# EAGLE schematic MainPower (EAGLE 9.6.2)

## Sheet 1 of 2
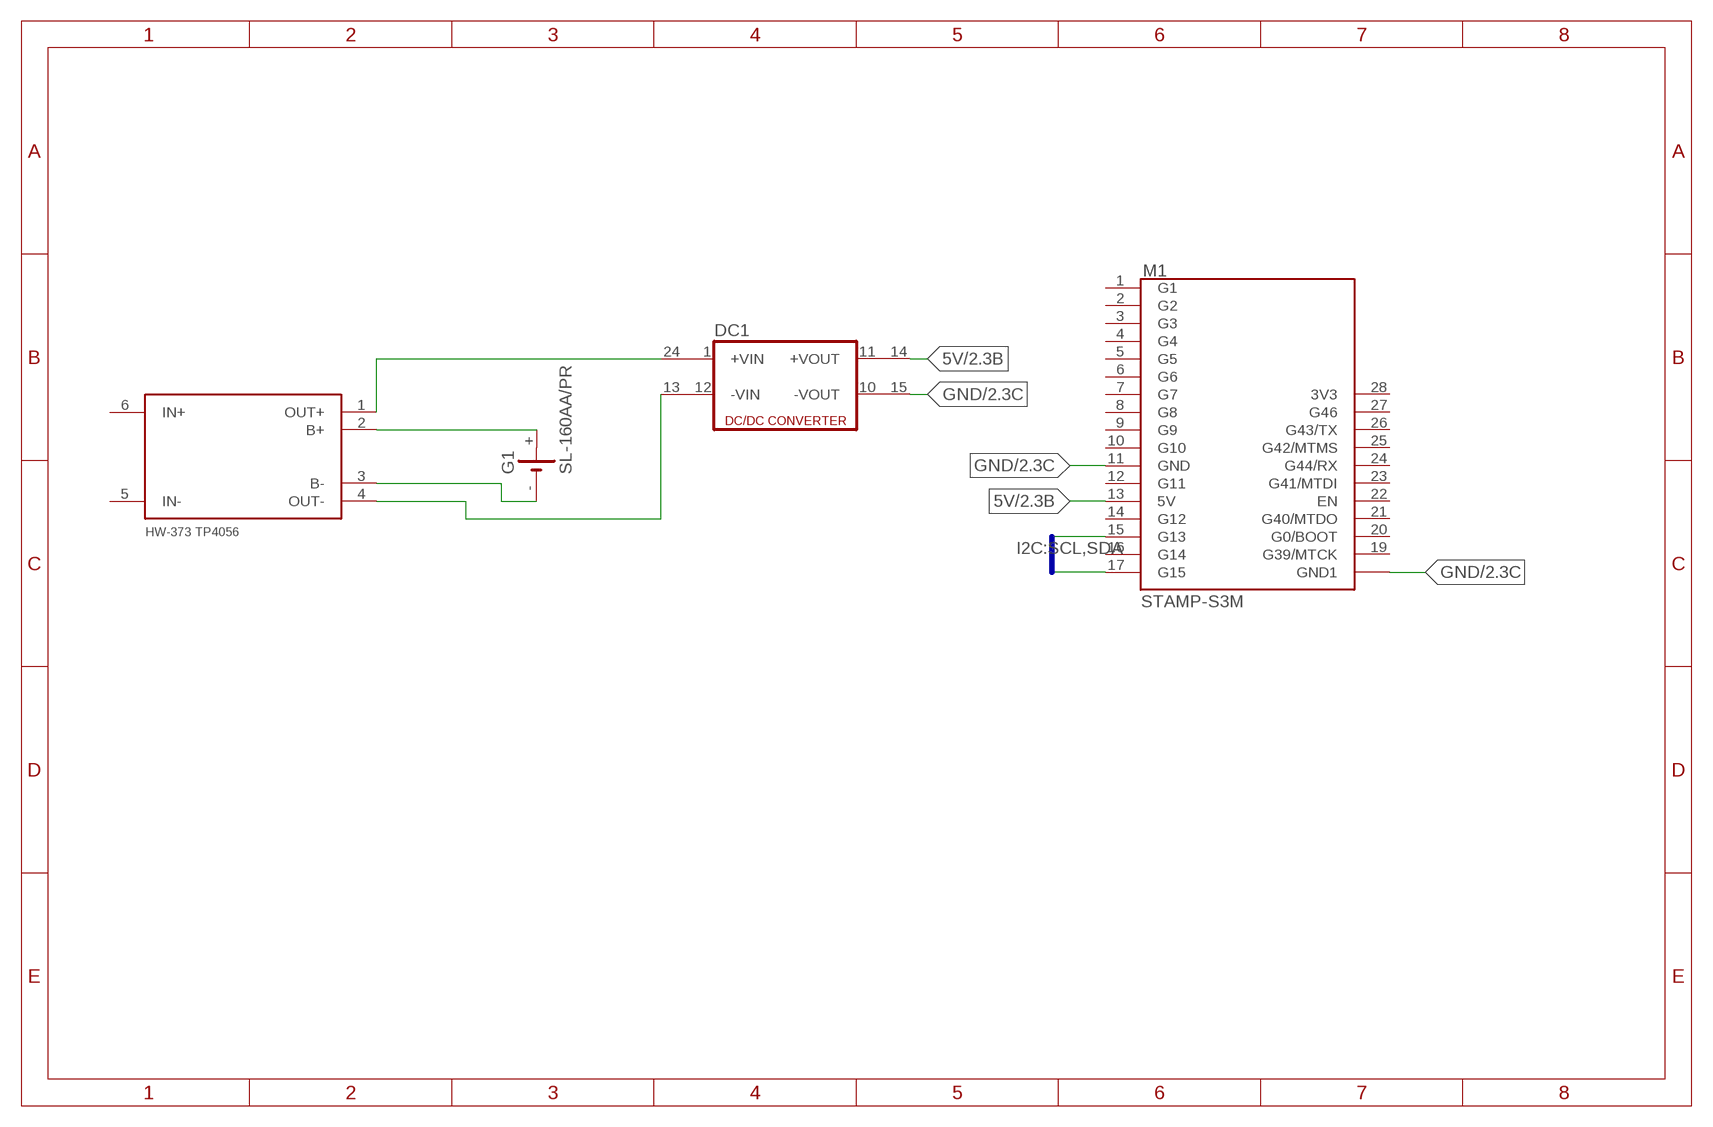
[diagram p0: schematic, sheet 1]

### Parts
DC1  DC213R  [CMK]
G1  SL-160AA/PR  [SL-160AA/PR]
U$1  TP4056  [TP4056_FTP]
U$2  STAMP-S3M-PIN  [STAMPS3_PIN_FTP]

### Nets
5V: DC1.14(+VOUT1) U$2.13(5V) ; also sheet 2
GND: DC1.15(-VOUT1) U$2.11(GND) U$2.18(GND1) ; also sheet 2
N$2: G1.+ U$1.2(B+)
N$3: G1.- U$1.3(B-)
N$4: DC1.13(-VIN1) U$1.4(OUT-)
N$5: DC1.24(+VIN1) U$1.1(OUT+)
SCL: U$2.17(G15) ; also sheet 2
SDA: U$2.15(G13) ; also sheet 2
Unconnected: DC1.1(+VIN) DC1.10(-VOUT) DC1.11(+VOUT) DC1.12(-VIN) U$1.5(IN-) U$2.1(G1) U$2.2(G2) U$2.3(G3) U$2.4(G4) U$2.5(G5) U$2.6(G6) U$2.7(G7) U$2.8(G8) U$2.9(G9) U$2.10(G10) U$2.12(G11) U$2.14(G12) U$2.16(G14) U$2.19(G39/MTCK) U$2.20(G0/BOOT) U$2.21(G40/MTDO) U$2.22(EN) U$2.23(G41/MTDI) U$2.24(G44/RX) U$2.25(G42/MTMS) U$2.26(G43/TX) U$2.27(G46)

### Buses
I2C:SCL,SDA

## Sheet 2 of 2
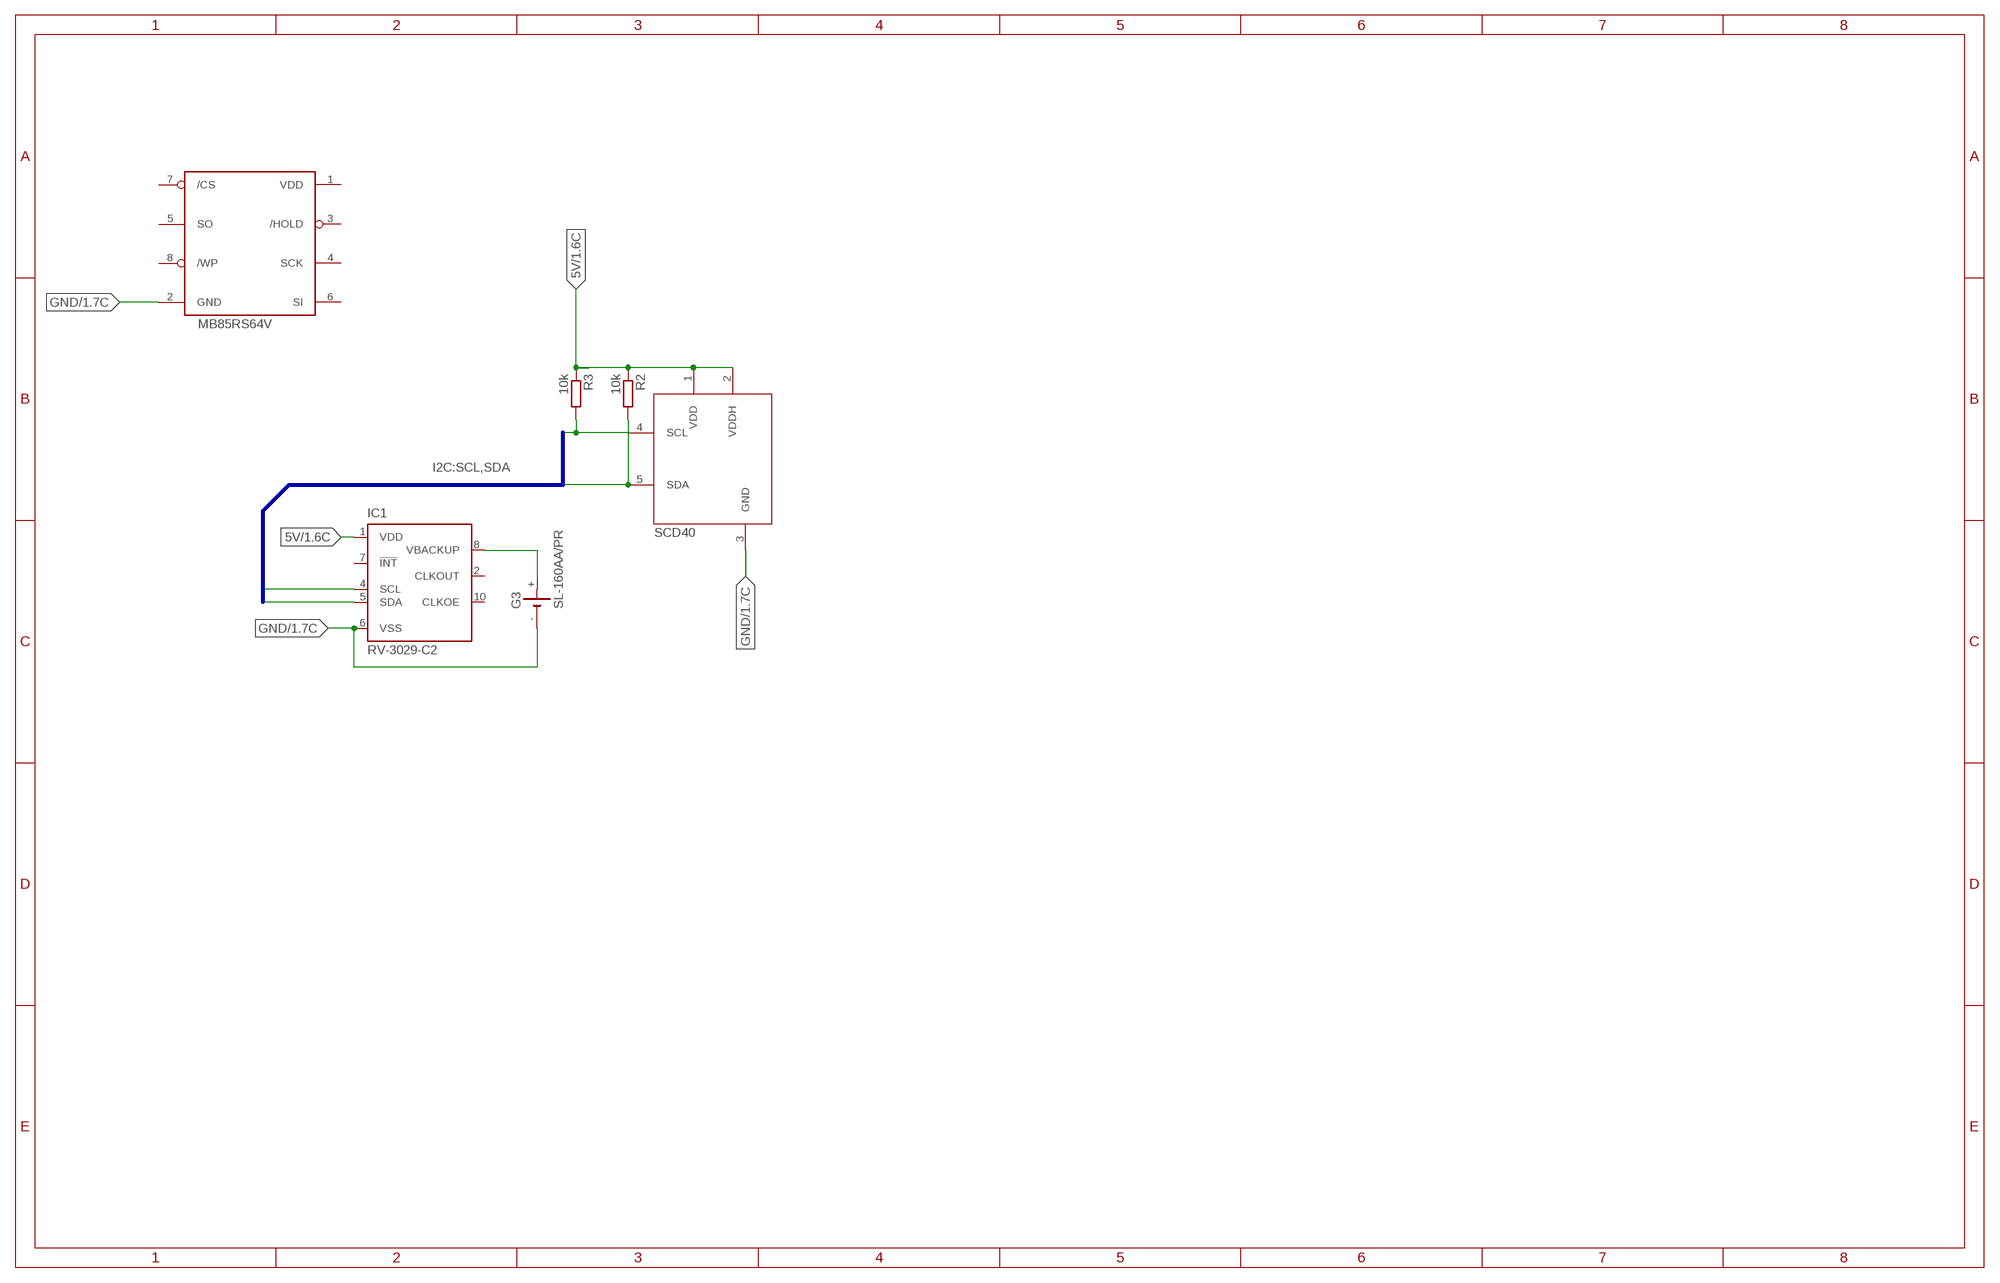
[diagram p1: schematic, sheet 2]

### Parts
G3  SL-160AA/PR  [SL-160AA/PR]
IC1  RV-3029-C2  [SON-10]
R2  10k  R-EU_0204/2V  [0204V]
R3  10k  R-EU_0204/2V  [0204V]
U$3  FRAM  [FRAMFT]
U$4  SCD40  [SCD-40FT]

### Nets
5V: IC1.1(VDD) R2.1 R3.1 U$4.1(VDD) U$4.2(VDDH) ; also sheet 1
GND: G3.- IC1.6(VSS) U$3.2(GND) U$4.3(GND) ; also sheet 1
N$1: G3.+ IC1.8(VBACKUP)
SCL: IC1.4(SCL) R3.2 U$4.4(SCL) ; also sheet 1
SDA: IC1.5(SDA) R2.2 U$4.5(SDA) ; also sheet 1
Unconnected: IC1.2(CLKOUT) IC1.7(!INT) IC1.10(CLKOE) U$3.1(VDD) U$3.3(/HOLD) U$3.4(SCK) U$3.5(SO) U$3.6(SI) U$3.7(/CS) U$3.8(/WP)

### Buses
I2C:SCL,SDA

## Power pins joined to a net without a drawn wire
3V3: U$2.28(3V3)
IN+: U$1.6(IN+)

## Library data of the parts
DC1 = dc-dc-converter:DC213R: DC-DC CONVERTER; OC_FARNELL: unknown; OC_NEWARK: unknown
G1 G3 = battery:SL-160AA/PR: LI BATTERY Sonnenschein
IC1 = crystal:RV-3029-C2: Highly accurate, DTCXO Temperature Compensated Real Time Clock / Calendar Module with I2C Interface. Source: Data shhet <http://www.mcrystal.ch/Resources/PDFs/DataSheet/Real-Time-Clocks/RV-3029-C2.aspx>
R2 R3 = rcl:R-EU_: RESISTOR, European symbol; SPICEPREFIX: R
U$1 = TP4056:TP4056
U$2 = StampS3:STAMP-S3M-PIN
U$3 = fram:FRAM
U$4 = SCD40:SCD40